# EAGLE design GNSS-proto (EAGLE 9.6.2)
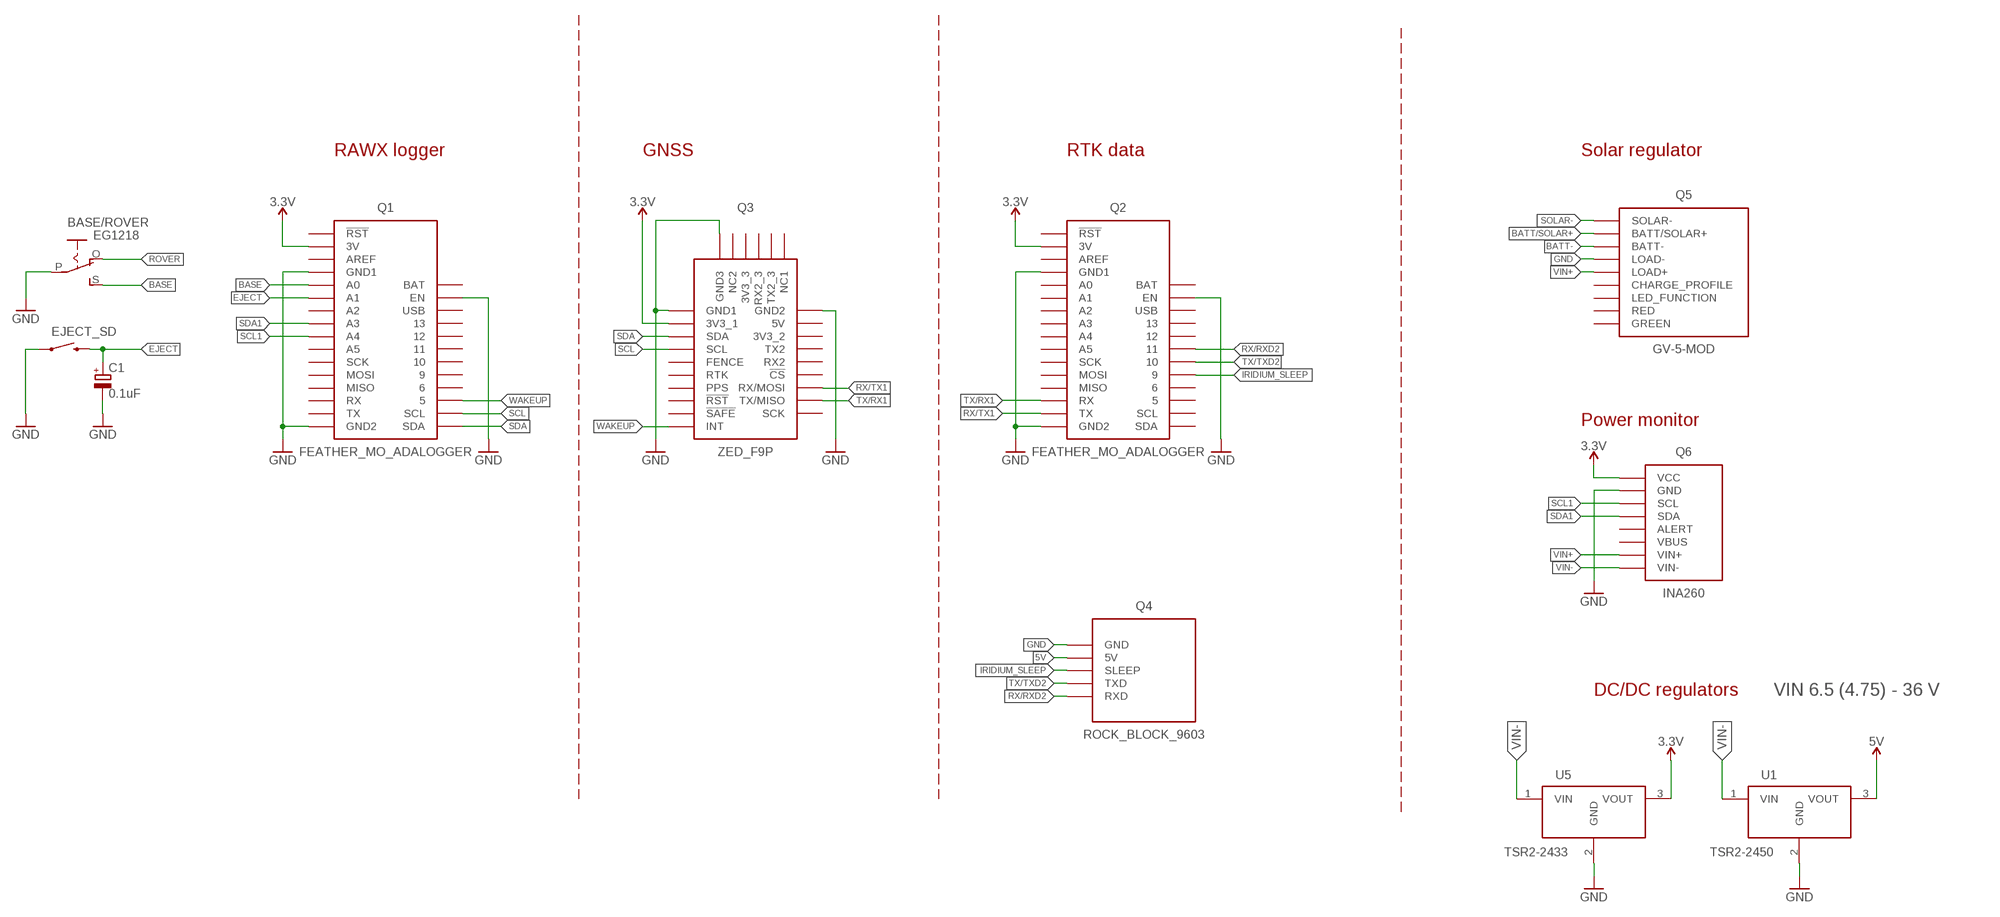
[diagram p0: schematic, sheet 1]

## Parts
BASE/ROVER  EG1218  EG1218S  [EG1218]
C1  0.1uF  CPOL-EUE2,5-6E  [E2,5-6E]
EJECT_SD  SWITCH-MOMENTARY-2PTH  [TACTILE-PTH]
Q1  FEATHER_MO_ADALOGGER  [FEATHER_M0_ADALOGGER]
Q2  FEATHER_MO_ADALOGGER  [FEATHER_M0_ADALOGGER]
Q3  ZED_F9P  [ZED_F9P]
Q4  ROCK_BLOCK_9603  [ROCK_BLOCK_9603]
Q5  GV-5-MOD  [GV-5-MOD]
Q6  INA260  [INA260]
U1  TSR2-2450  173010535  [173010535]
U5  TSR2-2433  173010535  [173010535]

## Nets
3.3V: Q1.3V Q2.3V Q3.3V3_1 Q6.VCC U5.3(VOUT)
5V: Q4.5V U1.3(VOUT)
BASE: BASE/ROVER.S Q1.A0
BATT-: Q5.BATT-1(BATT-) Q5.BATT-2(BATT-) Q5.BATT-3(BATT-) Q5.BATT-4(BATT-)
BATT/SOLAR+: Q5.BATT/SOLAR+1(BATT/SOLAR+) Q5.BATT/SOLAR+2(BATT/SOLAR+) Q5.BATT/SOLAR+3(BATT/SOLAR+) Q5.BATT/SOLAR+4(BATT/SOLAR+)
EJECT: C1.+ EJECT_SD.3 Q1.A1
GND: BASE/ROVER.P C1.- EJECT_SD.1 Q1.EN Q1.GND1 Q1.GND2 Q2.EN Q2.GND1 Q2.GND2 Q3.GND1 Q3.GND2 Q3.GND3 Q4.GND1(GND) Q4.GND2(GND) Q5.LOAD-1(LOAD-) Q5.LOAD-2(LOAD-) Q5.LOAD-3(LOAD-) Q5.LOAD-4(LOAD-) Q6.GND U1.2(GND) U5.2(GND)
IRIDIUM_SLEEP: Q2.9 Q4.SLEEP
ROVER: BASE/ROVER.O
RX/RXD2: Q2.11 Q4.RXD
RX/TX1: Q2.TX Q3.RX/MOSI
SCL: Q1.SCL Q3.SCL
SCL1: Q1.A4 Q6.SCL
SDA: Q1.SDA Q3.SDA
SDA1: Q1.A3 Q6.SDA
SOLAR-: Q5.SOLAR-1(SOLAR-) Q5.SOLAR-2(SOLAR-) Q5.SOLAR-3(SOLAR-) Q5.SOLAR-4(SOLAR-)
TX/RX1: Q2.RX Q3.TX/MISO
TX/TXD2: Q2.10 Q4.TXD
VIN+: Q5.LOAD+1(LOAD+) Q5.LOAD+2(LOAD+) Q5.LOAD+3(LOAD+) Q5.LOAD+4(LOAD+) Q6.VIN+1(VIN+) Q6.VIN+2(VIN+)
VIN-: Q6.VIN-1(VIN-) Q6.VIN-2(VIN-) U1.1(VIN) U5.1(VIN)
WAKEUP: Q1.5 Q3.INT
Unconnected: Q1.6 Q1.9 Q1.10 Q1.11 Q1.12 Q1.13 Q1.!RST Q1.A2 Q1.A5 Q1.AREF Q1.BAT Q1.MISO Q1.MOSI Q1.RX Q1.SCK Q1.TX Q1.USB Q2.5 Q2.6 Q2.12 Q2.13 Q2.!RST Q2.A0 Q2.A1 Q2.A2 Q2.A3 Q2.A4 Q2.A5 Q2.AREF Q2.BAT Q2.MISO Q2.MOSI Q2.SCK Q2.SCL Q2.SDA Q2.USB Q3.3V3_2 Q3.3V3_3 Q3.5V Q3.!CS Q3.!RST Q3.!SAFE Q3.FENCE Q3.NC_1(NC1) Q3.NC_2(NC2) Q3.PPS Q3.RTK Q3.RX2 Q3.RX2_3 Q3.SCK Q3.TX2 Q3.TX2_3 Q5.CHG_PROFILE(CHARGE_PROFILE) Q5.GREEN Q5.LED_FUNCTION Q5.RED Q6.ALERT Q6.VBUS

## Notes on the sheet
- RAWX logger | GNSS | RTK data | Solar regulator
- Power monitor
- DC/DC regulators | VIN 6.5 (4.75) - 36 V

## Library data of the parts
BASE/ROVER = adafruit:EG1218: SLIDING SWITCH 0.1" spacing through hole, vertical SPDT slide switch http://www.ladyada.net/library/pcb/eaglelibrary.html
C1 = rcl:CPOL-EU: POLARIZED CAPACITOR, European symbol; SPICEPREFIX: C
EJECT_SD = SparkFun-Electromechanical:SWITCH-MOMENTARY-2: Various NO switches- pushbuttons, reed, etc; PROD_ID: SWCH-08441
Q1 Q2 = GNSS-proto:FEATHER_MO_ADALOGGER
Q3 = GNSS-proto:ZED_F9P
Q4 = GNSS-proto:ROCK_BLOCK_9603
Q5 = GNSS-proto:GV-5-MOD
Q6 = GNSS-proto:INA260
U1 U5 = DC-DC Converter:173010535: FDSM FIXED STEP DOWN REGULATOR M Manufacturer's datasheet <https://www.we-online.com/catalog/datasheet/173010335.pdf>; CREATED_BY: PCBLayout.com; DIGIKEY_PARTNO: 732-173010535-ND; MANUFACTURER: Würth Elektronik; MPN: 173010535

## Board
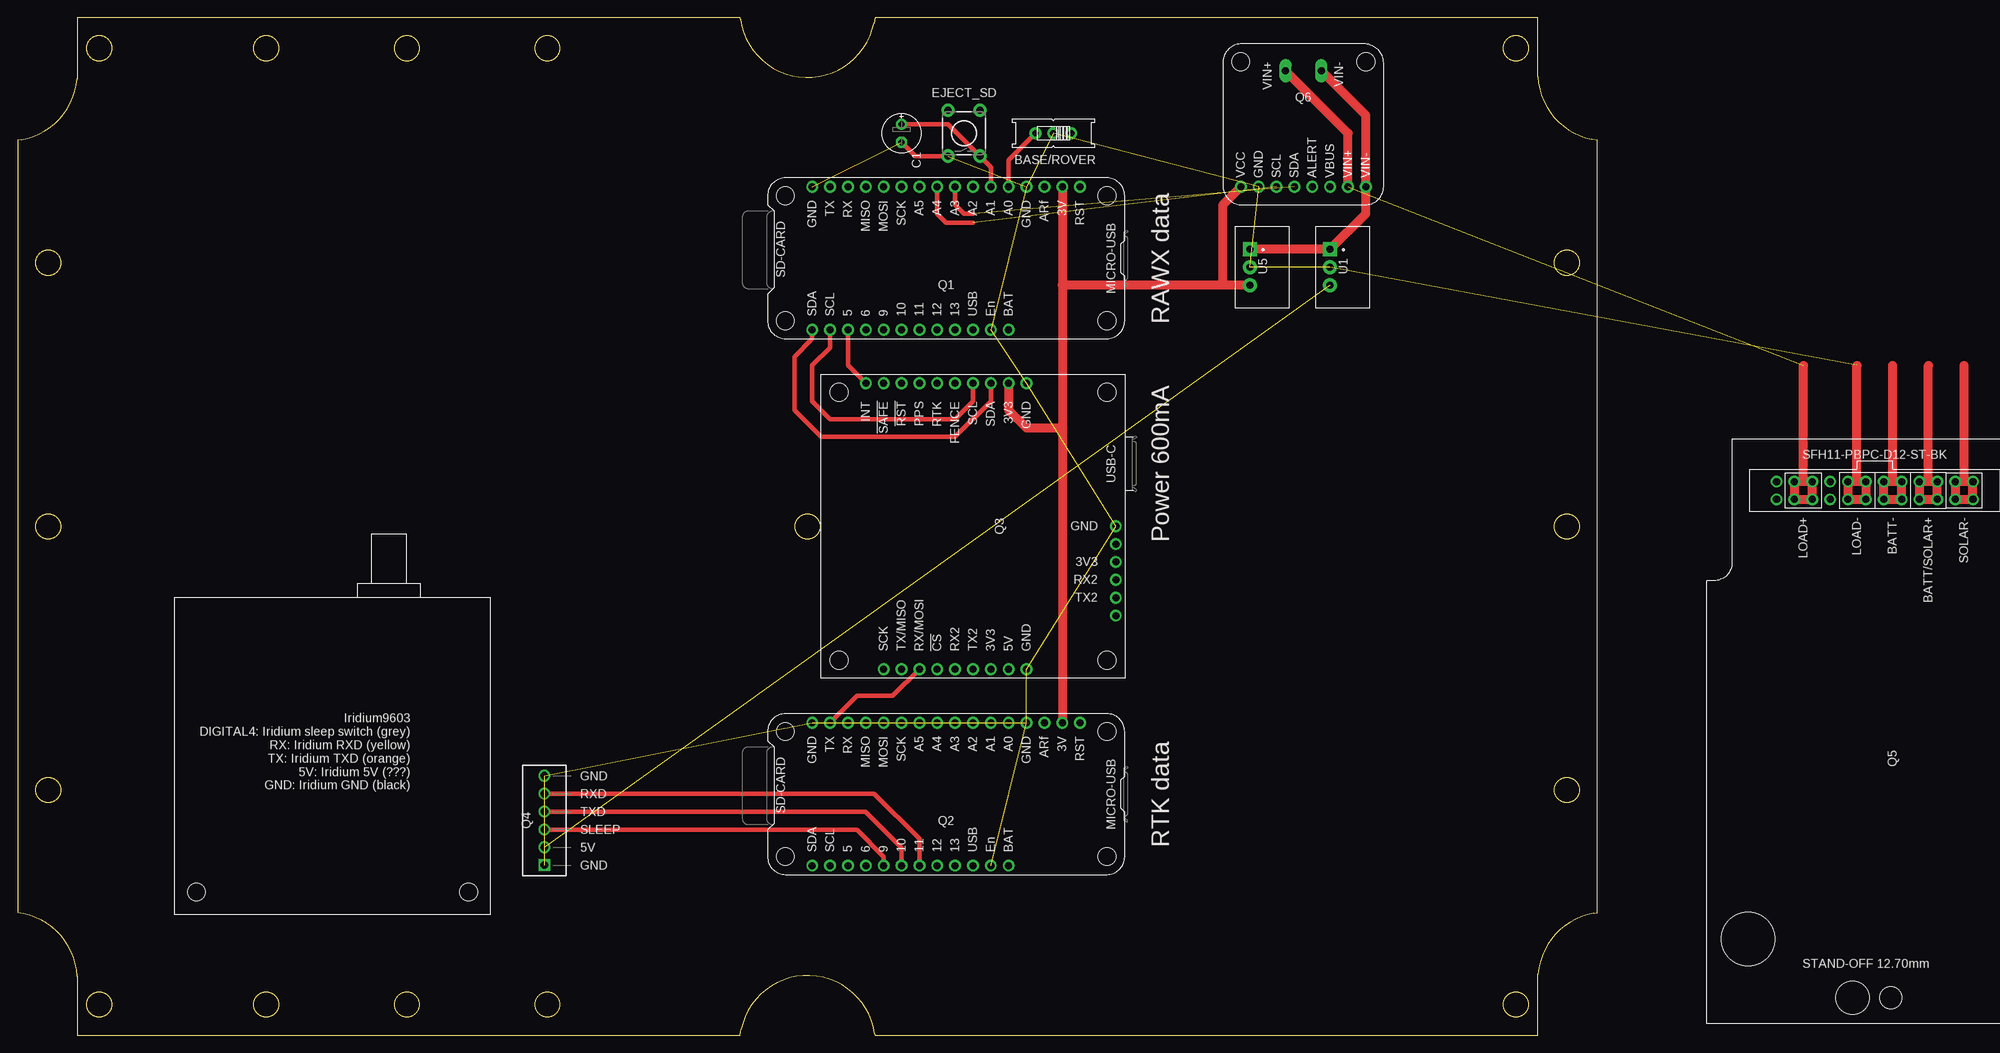
[diagram p1: board, top side]
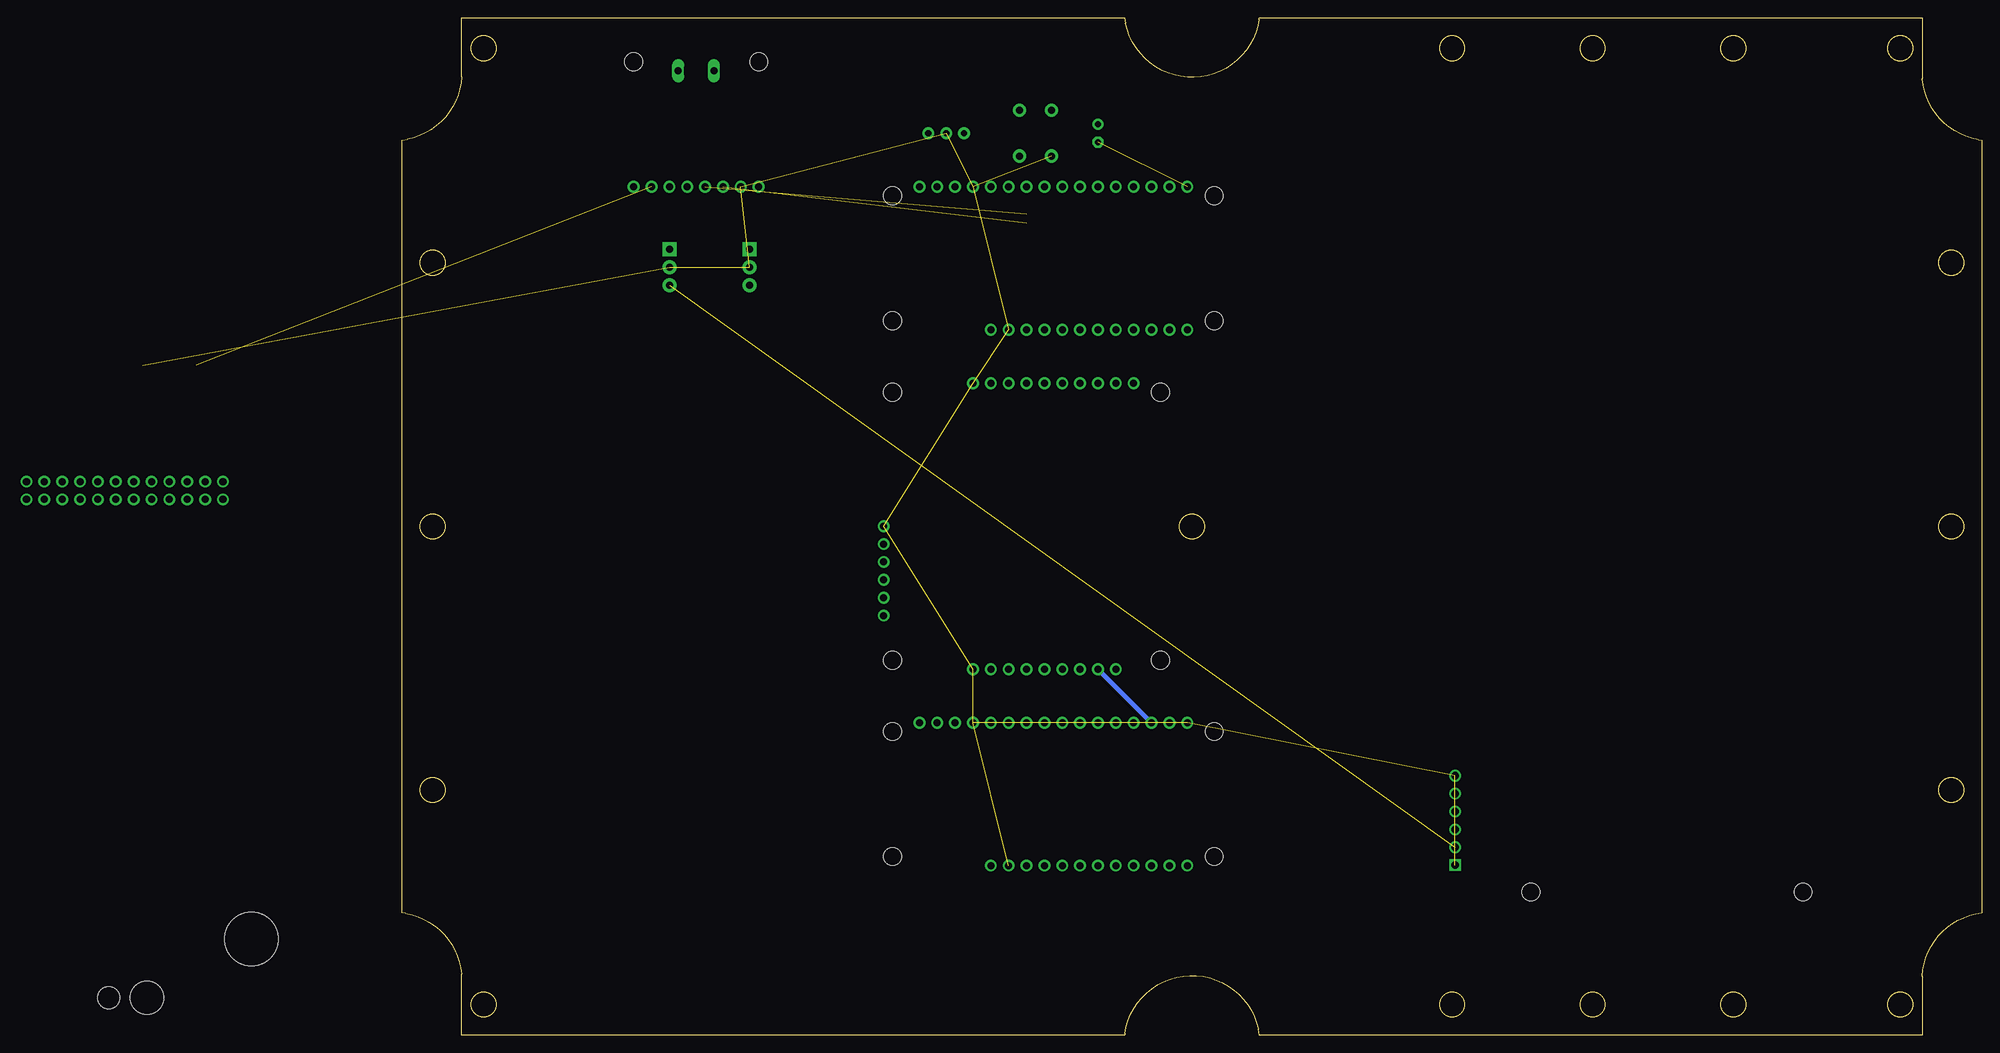
[diagram p2: board, bottom side, seen from below]

Size 224.72 x 144.72 mm. Coordinates in mm from the lower left corner, seen from the top.
Outline: 102.82,144.48 102.78,144.72 8.5,144.72 8.5,136.86 8.46,136.02 arc-75 0.53,127.36 0,127.28 0,17.43 arc-80 8.48,8.4 8.5,7.86 8.5,0 102.78,0 102.92,0.83 arc-160 121.9,0.23 121.93,0 216.22,0 216.22,7.86 216.25,8.7 arc-75 224.18,17.35 224.72,17.43 224.72,127.28 223.89,127.42 arc-75 216.23,136.32 216.22,136.86 216.22,144.72 121.93,144.72 121.8,143.89 arc-160 102.82,144.48
Outline: circle at 220.36,72.36 radius 1.75
Outline: circle at 213.11,140.36 radius 1.75
Outline: circle at 55.36,4.36 radius 1.75
Outline: circle at 4.36,109.86 radius 1.75
Outline: circle at 213.11,4.36 radius 1.75
Outline: circle at 4.36,34.86 radius 1.75
Outline: circle at 220.36,34.86 radius 1.75
Outline: circle at 35.36,4.36 radius 1.75
Outline: circle at 11.61,140.36 radius 1.75
Outline: circle at 220.36,109.86 radius 1.75
Outline: circle at 75.36,140.36 radius 1.75
Outline: circle at 4.36,72.36 radius 1.75
Outline: circle at 75.36,4.36 radius 1.75
Outline: circle at 55.36,140.36 radius 1.75
Outline: circle at 35.36,140.36 radius 1.75
Outline: circle at 11.61,4.36 radius 1.75
Outline: circle at 112.36,72.36 radius 1.75
Copper layers (1*16): Top 0.018mm / dielectric 1.55mm / Bottom 0.018mm
Design rules "eC_2Layer_PClass6_BaseCopperO18_eCDefault": minimum track width 0.15mm, minimum drill 0.35mm, track to track 0.15mm, track to pad 0.15mm, pad to pad 0.15mm, via to via 0.15mm, smd to smd 0mil, copper to edge 0.25mm, drill to drill 0.35mm, minimum pad ring 0.175mm, minimum via ring 0.125mm, stop-mask expansion 0mil, vias tented up to drill 0.45mm, thermal gap 0.2mm

### Footprints (pad centres in the part's own frame; a part is rotated, then mirrored left to right if it is on the bottom)
EG1218 = drill 0.9 pad 1.676: O -2.54,0; P 0,0; S 2.54,0
E2,5-6E = drill 0.813 pad 1.575: + -1.27,0 | drill 0.813 pad 1.575 octagon: - 1.27,0
TACTILE-PTH = drill 1.016 pad 1.88: 1 -3.251,2.261; 2 3.251,2.261; 3 -3.251,-2.261; 4 3.251,-2.261
FEATHER_M0_ADALOGGER = drill 1 pad 1.676: 3V 8.89,1.27; 5 39.37,21.59; 6 36.83,21.59; 9 34.29,21.59; 10 31.75,21.59; 11 29.21,21.59; 12 26.67,21.59; 13 24.13,21.59; !RST 6.35,1.27; A0 16.51,1.27; A1 19.05,1.27; A2 21.59,1.27; A3 24.13,1.27; A4 26.67,1.27; A5 29.21,1.27; AREF 11.43,1.27; BAT 16.51,21.59; EN 19.05,21.59; GND1 13.97,1.27; GND2 44.45,1.27; MISO 36.83,1.27; MOSI 34.29,1.27; RX 39.37,1.27; SCK 31.75,1.27; SCL 41.91,21.59; SDA 44.45,21.59; TX 41.91,1.27; USB 21.59,21.59 | hole 2.54: 48.26,20.32; 48.26,2.54; 2.54,20.32; 2.54,2.54
ZED_F9P = drill 1 pad 1.676: 3V3_1 1.27,26.67; 3V3_2 41.91,24.13; 3V3_3 26.67,41.91; 5V 41.91,26.67; !CS 41.91,16.51; !RST 1.27,11.43; !SAFE 1.27,8.89; FENCE 1.27,19.05; GND1 1.27,29.21; GND2 41.91,29.21; GND3 21.59,41.91; INT 1.27,6.35; NC_1 34.29,41.91; NC_2 24.13,41.91; PPS 1.27,13.97; RTK 1.27,16.51; RX2 41.91,19.05; RX2_3 29.21,41.91; RX/MOSI 41.91,13.97; SCK 41.91,8.89; SCL 1.27,21.59; SDA 1.27,24.13; TX2 41.91,21.59; TX2_3 31.75,41.91; TX/MISO 41.91,11.43 | hole 2.54: 2.54,2.54; 2.54,40.64; 40.64,40.64; 40.64,2.54
ROCK_BLOCK_9603 = drill 1.1 pad 1.65: 5V -7.62,35.49; GND2 -7.62,25.33; RXD -7.62,27.87; SLEEP -7.62,32.95; TXD -7.62,30.41 | drill 1.1 pad 1.65 square: GND1 -7.62,38.03 | hole 2.54: 41.85,41.85; 3.15,41.85
GV-5-MOD = drill 1 pad 1.676: BATT-1 -1.27,1.27; BATT-2 1.27,1.27; BATT-3 -1.27,3.81; BATT-4 1.27,3.81; BATT/SOLAR+1 -1.27,6.35; BATT/SOLAR+2 1.27,6.35; BATT/SOLAR+3 -1.27,8.89; BATT/SOLAR+4 1.27,8.89; CHG_PROFILE -1.27,-6.35; GREEN 1.27,-13.97; LED_FUNCTION 1.27,-6.35; LOAD+1 -1.27,-11.43; LOAD+2 1.27,-11.43; LOAD+3 -1.27,-8.89; LOAD+4 1.27,-8.89; LOAD-1 -1.27,-3.81; LOAD-2 1.27,-3.81; LOAD-3 -1.27,-1.27; LOAD-4 1.27,-1.27; RED -1.27,-13.97; SOLAR-1 -1.27,11.43; SOLAR-2 1.27,11.43; SOLAR-3 -1.27,13.97; SOLAR-4 1.27,13.97 | hole 4.75: 72.136,-3.175 | hole 3.175: 72.136,2.286 | hole 7.62: 63.779,-18.034
INA260 = drill 1 pad 1.676: ALERT 1.27,-8.89; GND -6.35,-8.89; SCL -3.81,-8.89; SDA -1.27,-8.89; VBUS 3.81,-8.89; VCC -8.89,-8.89; VIN+2 6.35,-8.89; VIN-2 8.89,-8.89 | drill 1 pad 1.676 long: VIN+1 -2.54,7.62; VIN-1 2.54,7.62 | hole 2.54: -8.89,8.89; 8.89,8.89
173010535 = drill 1 pad 2 square: 1 -2.54,0 | drill 1 pad 2: 2 0,0; 3 2.54,0

### Placement (x,y rotation side)
BASE/ROVER  147.32,128.27 180 top
C1  125.73,128.27 270 top
EJECT_SD  134.62,128.27 90 top
Q1  157.48,121.92 180 top
Q2  157.48,45.72 180 top
Q3  114.3,93.98 270 top
Q4  67.31,62.23 180 top
Q5  264.16,77.47 270 top  (outside the outline)
Q6  182.88,129.54 0 top
U1  186.69,109.22 270 top
U5  175.26,109.22 270 top

### Tracks (layer width: path | path; a pad name or v marks a point on that pad's centre or on a via)
3.3V
  Top 1.27: Q1.3V 148.59,106.68 | 148.59,106.68 148.59,86.36 | 148.59,86.36 Q2.3V | 148.59,86.36 143.51,86.36 140.97,88.9 Q3.3V3_1 | U5.3 171.45,106.68 | 171.45,106.68 171.45,118.11 Q6.VCC | 171.45,106.68 148.59,106.68
5V  (1 unrouted)
BASE
  Top 0.61: Q1.A0 140.97,124.46 BASE/ROVER.S
BATT-
  Top 1.27: 266.7,78.74 Q5.BATT-3 Q5.BATT-4 Q5.BATT-2 Q5.BATT-1 266.7,78.74 | 266.7,78.74 266.7,95.25
BATT/SOLAR+
  Top 1.27: 271.78,78.74 Q5.BATT/SOLAR+3 Q5.BATT/SOLAR+4 Q5.BATT/SOLAR+2 Q5.BATT/SOLAR+1 271.78,78.74 | 271.78,78.74 271.78,95.25
EJECT
  Top 0.61: Q1.A1 138.43,123.47 EJECT_SD.3 132.36,129.54 C1.+
GND  (16 unrouted)
  Top 0.61: EJECT_SD.1 127.71,125.02 C1.-
  Top 1.27: 261.62,78.74 Q5.LOAD-3 Q5.LOAD-4 Q5.LOAD-2 Q5.LOAD-1 261.62,78.74 | 261.62,78.74 261.62,95.25
IRIDIUM_SLEEP
  Top 0.61: Q2.9 123.19,25.4 119.38,29.21 75,29.21 Q4.SLEEP
RX/RXD2
  Top 0.61: Q2.11 128.27,27.94 121.85,34.36 Q4.RXD
RX/TX1
  Top 0.61: Q2.TX 119.38,48.26 124.46,48.26 Q3.RX/MOSI
SCL
  Top 0.61: Q1.SCL 115.57,97.79 113.03,95.25 113.03,90.17 115.57,87.63 133.35,87.63 135.89,90.17 Q3.SCL
SCL1  (1 unrouted)
  Top 0.61: Q1.A4 130.81,116.84 132.08,115.57 135.89,115.57
SDA
  Top 0.61: Q3.SDA 138.43,90.17 133.35,85.09 114.3,85.09 110.49,88.9 110.49,96.52 113.03,99.06 Q1.SDA
SDA1  (1 unrouted)
  Top 0.61: Q1.A3 133.35,118.11 134.62,116.84 135.89,116.84
SOLAR-
  Top 1.27: 276.86,78.74 Q5.SOLAR-3 Q5.SOLAR-4 Q5.SOLAR-2 Q5.SOLAR-1 276.86,78.74 | 276.86,78.74 276.86,95.25
TX/RX1
  Bottom 0.61: Q2.RX Q3.TX/MISO
TX/TXD2
  Top 0.61: Q2.10 125.73,26.67 120.58,31.82 Q4.TXD
VIN+  (1 unrouted)
  Top 1.27: 254,78.74 Q5.LOAD+3 Q5.LOAD+4 Q5.LOAD+2 Q5.LOAD+1 254,78.74 | 254,78.74 254,95.25 | Q6.VIN+2 189.23,128.27 Q6.VIN+1
VIN-
  Top 1.27: Q6.VIN-1 191.77,130.81 Q6.VIN-2 191.77,116.84 U1.1 U5.1
WAKEUP
  Top 0.61: Q3.INT 118.11,95.25 Q1.5

### Text on the board
tPlace: RAWX data | Power 600mA | RTK data